# Altium schematic sheet Sheet2.SchDoc
size A2
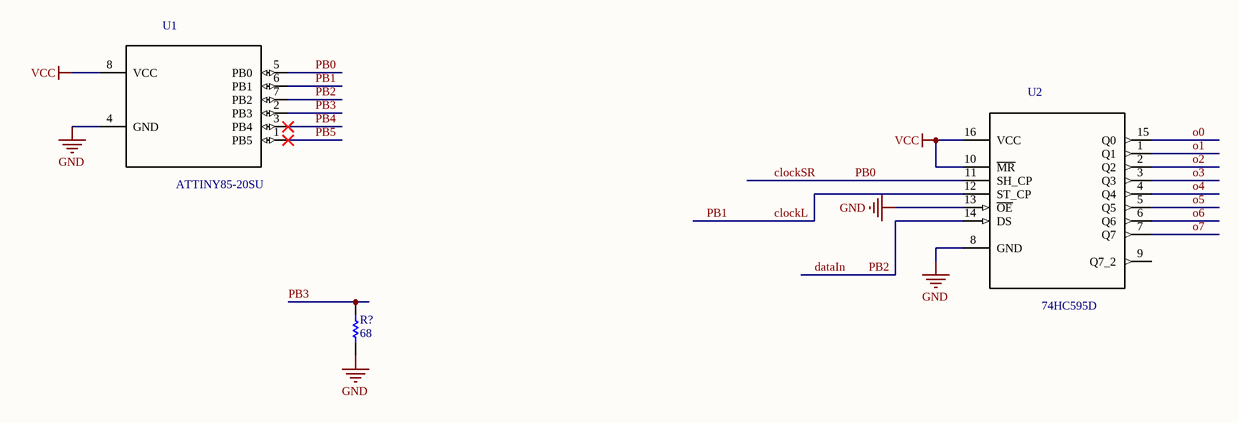
[diagram p0: Sheet2.SchDoc]

## Parts
R?  68  [0805]
U1  ATTINY85-20SU  [*SOIC127P798X216-8N]
U2  74HC595D  [*SOIC127P600X175-16N]

## Nets
GND: R?.1 U1.4(GND) U2.8(GND) U2.13(~{OE})
VCC: U1.8(VCC) U2.10(~{MR}) U2.16(VCC)
clockL: U1.6(PB1) U2.12(ST_CP)  [also labelled PB1]
clockSR: U1.5(PB0) U2.11(SH_CP)  [also labelled PB0]
dataIn: U1.7(PB2) U2.14(DS)  [also labelled PB2]
o0: U2.15(Q0)
o1: U2.1(Q1)
o2: U2.2(Q2)
o3: U2.3(Q3)
o4: U2.4(Q4)
o5: U2.5(Q5)
o6: U2.6(Q6)
o7: U2.7(Q7)
PB3: R?.2 U1.2(PB3)
PB4: U1.3(PB4)
PB5: U1.1(PB5)

Not connected (* = marked no-connect by the designer): U2 9(Q7_2)

## Library data of the parts
R? = RES
U1 = ATTINY85-20SU: AVR AVRÂ® ATtiny Microcontroller IC 8-Bit 20MHz 8KB _4K x 16_ FLASH 8-SOIC; MF: Microchip; Package: SOIC-8 Atmel; Availability: Unavailable; SnapEDA_Link: https://www.snapeda.com/parts/ATTINY85-20SU/Microchip/view-part/46337/?ref=snap; MP: ATTINY85-20SU; Price: None; Value: *
U2 = 74HC595D: Shift Register Single 8-Bit Serial to Serial/Parallel 16-Pin SOIC T/R; MF: Toshiba; SnapEDA_Link: https://www.snapeda.com/parts/74HC595D/avi/view-part/4572485/?ref=snap; Price: None; Availability: Unavailable; MP: 74HC595D; Package: None; Value: *